# Altium schematic sheet Sheet1.SchDoc
size A4; SheetNumber: 1; SheetTotal: 1
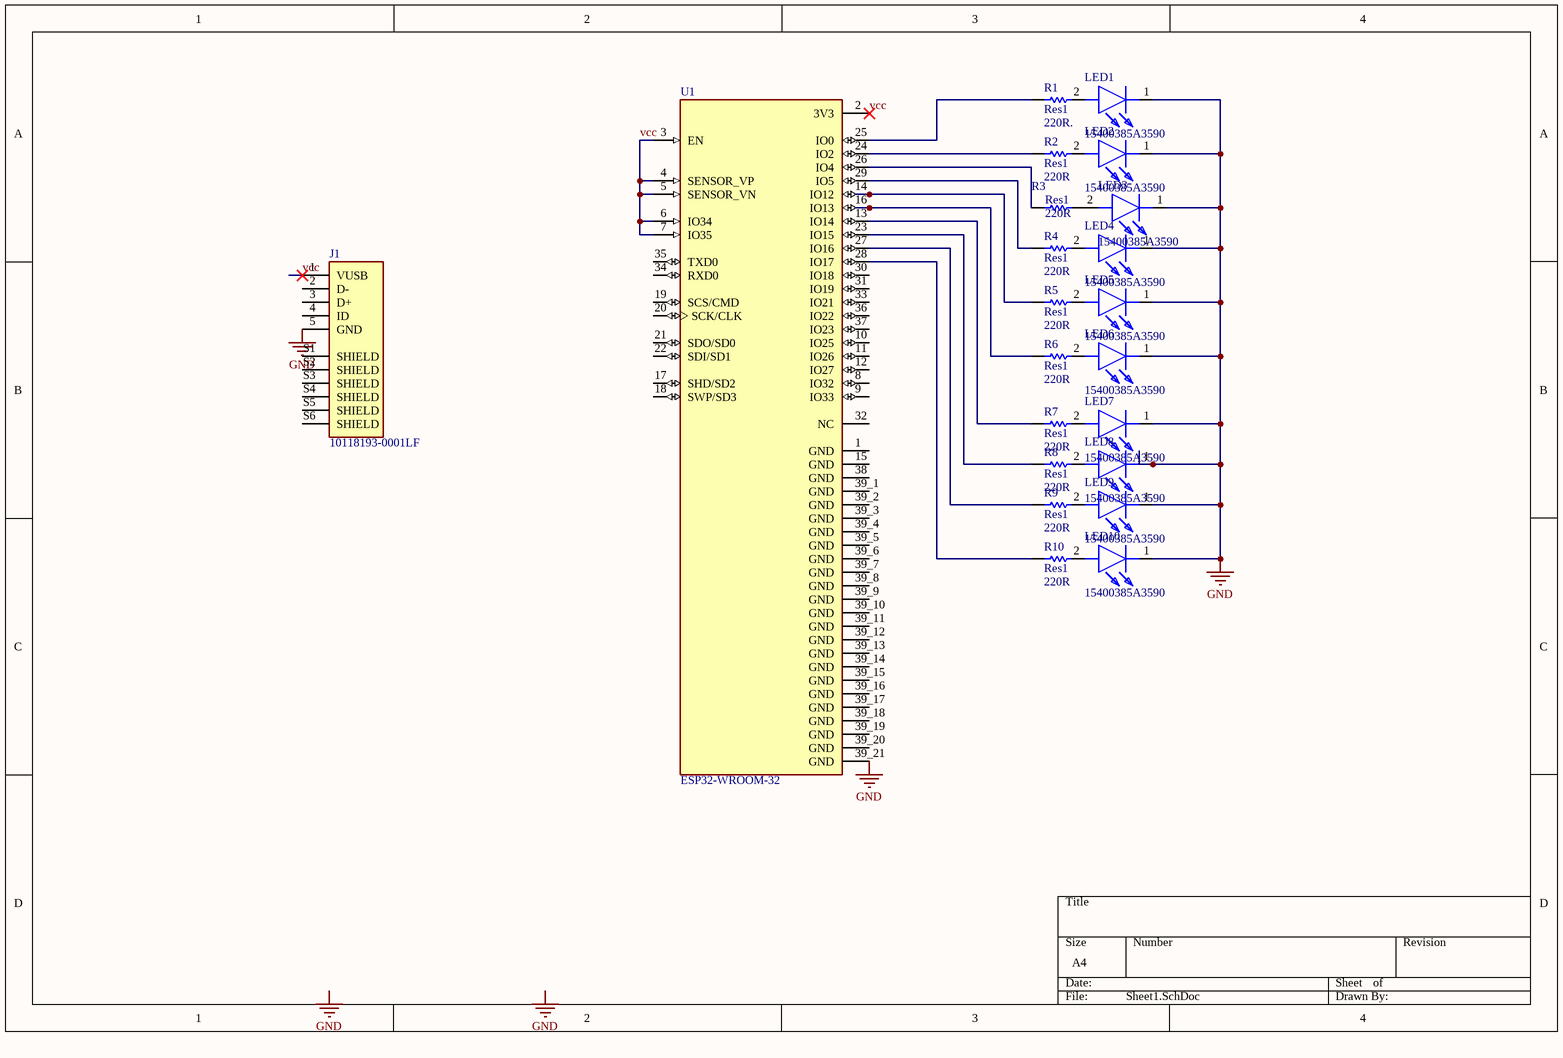
[diagram p0: Sheet1.SchDoc]

## Parts
J1  10118193-0001LF  [FCI_10118193-0001LF]
LED1  15400385A3590  [15400385A3590]
LED2  15400385A3590  [15400385A3590]
LED3  15400385A3590  [15400385A3590]
LED4  15400385A3590  [15400385A3590]
LED5  15400385A3590  [15400385A3590]
LED6  15400385A3590  [15400385A3590]
LED7  15400385A3590  [15400385A3590]
LED8  15400385A3590  [15400385A3590]
LED9  15400385A3590  [15400385A3590]
LED10  15400385A3590  [15400385A3590]
R1  Res1  value 220R.  [AXIAL-0.3]
R2  Res1  value 220R  [AXIAL-0.3]
R3  Res1  value 220R  [AXIAL-0.3]
R4  Res1  value 220R  [AXIAL-0.3]
R5  Res1  value 220R  [AXIAL-0.3]
R6  Res1  value 220R  [AXIAL-0.3]
R7  Res1  value 220R  [AXIAL-0.3]
R8  Res1  value 220R  [AXIAL-0.3]
R9  Res1  value 220R  [AXIAL-0.3]
R10  Res1  value 220R  [AXIAL-0.3]
U1  ESP32-WROOM-32  [MODULE_ESP32-WROOM-32]

## Nets
GND: J1.5(GND) LED1.1(K) LED2.1(K) LED3.1(K) LED4.1(K) LED5.1(K) LED6.1(K) LED7.1(K) LED8.1(K) LED9.1(K) LED10.1(K) U1.39_21(GND)
vcc: J1.1(VUSB) U1.2(3V3) U1.3(EN) U1.4(SENSOR_VP) U1.5(SENSOR_VN) U1.6(IO34) U1.7(IO35)
NetLED3_2: LED3.2(A) R3.2
NetR1_1: R1.1 U1.25(IO0)
NetR2_1: R2.1 U1.24(IO2)
NetR3_1: R3.1 U1.26(IO4)
NetR4_1: R4.1 U1.29(IO5)
NetR5_1: R5.1 U1.14(IO12)
NetR6_1: R6.1 U1.16(IO13)
NetR7_1: R7.1 U1.13(IO14)
NetR8_1: R8.1 U1.23(IO15)
NetR9_1: R9.1 U1.27(IO16)
NetR10_1: R10.1 U1.28(IO17)

Not connected (* = marked no-connect by the designer): J1 2(D-) 3(D+) 4(ID) S1(SHIELD) S2(SHIELD) S3(SHIELD) S4(SHIELD) S5(SHIELD) S6(SHIELD); LED1 2(A); LED2 2(A); LED4 2(A); LED5 2(A); LED6 2(A); LED7 2(A); LED8 2(A); LED9 2(A); LED10 2(A); R1 2; R2 2; R4 2; R5 2; R6 2; R7 2; R8 2; R9 2; R10 2; U1 1(GND) 8(IO32) 9(IO33) 10(IO25) 11(IO26) 12(IO27) 15(GND) 17(SHD/SD2) 18(SWP/SD3) 19(SCS/CMD) 20(SCK/CLK) 21(SDO/SD0) 22(SDI/SD1) 30(IO18) 31(IO19) 32(NC) 33(IO21) 34(RXD0) 35(TXD0) 36(IO22) 37(IO23) 38(GND) 39_1(GND) 39_2(GND) 39_3(GND) 39_4(GND) 39_5(GND) 39_6(GND) 39_7(GND) 39_8(GND) 39_9(GND) 39_10(GND) 39_11(GND) 39_12(GND) 39_13(GND) 39_14(GND) 39_15(GND) 39_16(GND) 39_17(GND) 39_18(GND) 39_19(GND) 39_20(GND)

## Notes on the sheet
- Labels drawn without touching a wire or pin: GND

## Library data of the parts
J1 = 10118193-0001LF: USB - micro B USB 2.0 Receptacle Connector 5 Position Surface Mount, Right Angle; Through Hole; MF: FCI; SnapEDA_Link: https://www.snapeda.com/parts/10118193-0001LF/Amphenol+FCI/view-part/?ref=snap; Package: None; MP: 10118193-0001LF; Check_prices: https://www.snapeda.com/parts/10118193-0001LF/Amphenol+FCI/view-part/?ref=eda; Purchase-URL: https://pricing.snapeda.com/search/part/10118193-0001LF/?ref=eda; Price: None; Value: *; Availability: In Stock
LED1-LED10 = 15400385A3590: LED; Manufacturer_Name: Wurth Elektronik; Datasheet Link: https://www.we-online.com/katalog/datasheet/15400385A3590.pdf; Height: 10.9mm; Manufacturer_Part_Number: 15400385A3590; Mouser Part Number: 710-15400385A3590; Mouser Price/Stock: https://www.mouser.co.uk/ProductDetail/Wurth-Elektronik/15400385A3590?qs=5aG0NVq1C4yszs1ddn0oOg%3D%3D
R1-R10 = Res1: Resistor; Published: 8-Jun-2000; LatestRevisionDate: 17-Jul-2002; LatestRevisionNote: Re-released for DXP Platform.; PackageReference: AXIAL-0.3; Publisher: Altium Limited; PackageDescription: Axial Device, Thru-Hole; 2 Leads; 0.3 in Pin Spacing
U1 = ESP32-WROOM-32: Bluetooth, WiFi 802.11b/g/n, Bluetooth v4.2 +EDR, Class 1, 2 and 3 Transceiver Module 2.4GHz ~ 2.5GHz Antenna Not Included, U.FL Surface Mount; MF: Espressif Systems; Price: None; Availability: In Stock; MP: ESP32-WROOM-32; Package: Module Espressif Systems; SnapEDA_Link: https://www.snapeda.com/parts/ESP32-WROOM-32/Espressif+Systems/view-part/?ref=snap; Check_prices: https://www.snapeda.com/parts/ESP32-WROOM-32/Espressif+Systems/view-part/?ref=eda; Value: *; Purchase-URL: https://pricing.snapeda.com/search/part/ESP32-WROOM-32/?ref=eda